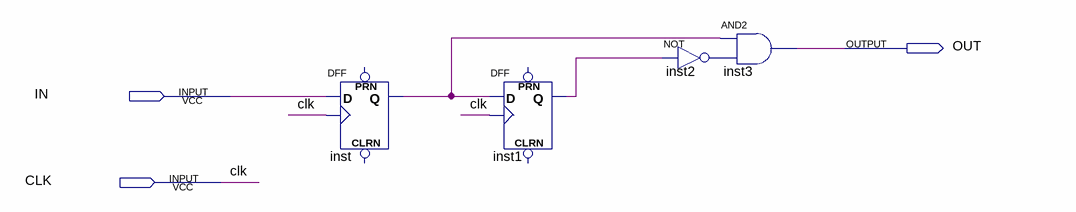
[diagram p0: schematic sheet]
// Quartus schematic RisingEdge.bdf as structural Verilog: 4 symbols, 3 pins
module RisingEdge (
  input  IN,
  input  CLK,
  output OUT
);

  wire inst1_q, inst2_out, inst_q;

  DFF inst (.CLK(CLK), .D(IN), .Q(inst_q));  // open: CLRN, PRN
  DFF inst1 (.CLK(CLK), .D(inst_q), .Q(inst1_q));  // open: CLRN, PRN
  not inst2 (inst2_out, inst1_q);
  and inst3 (OUT, inst_q, inst2_out);
endmodule
